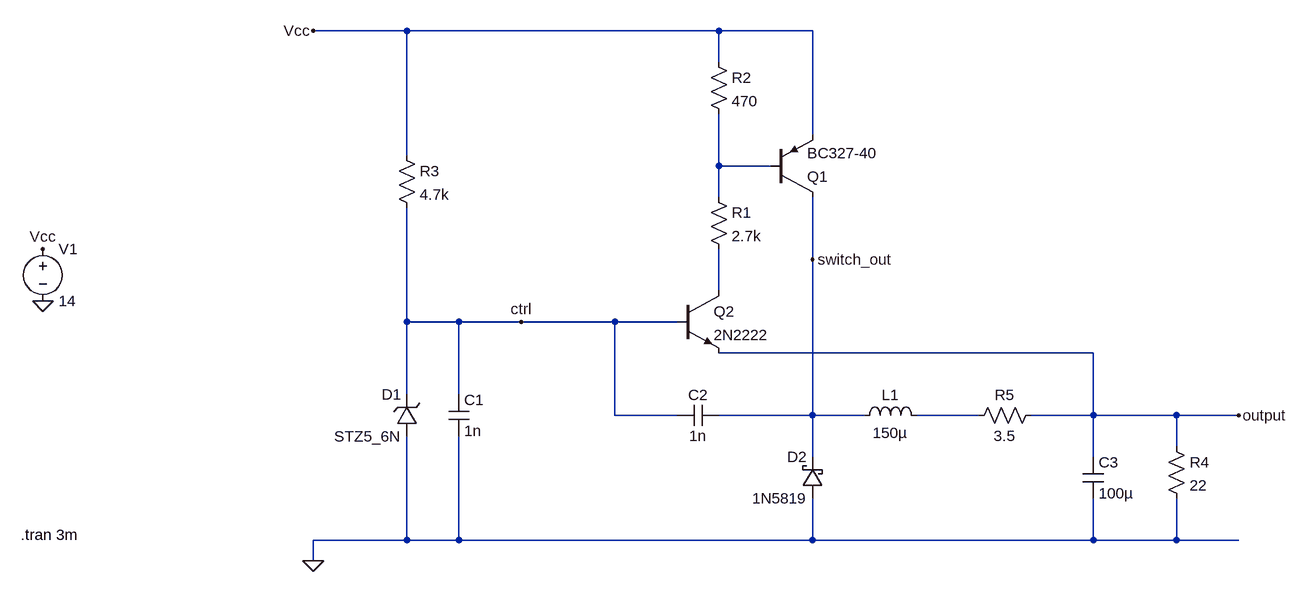
[diagram p0: schematic black_regulator.asc]
black_regulator.asc, the LTspice schematic file:
Version 4
SHEET 1 1008 788
WIRE -368 -48 -512 -48
WIRE 112 -48 -368 -48
WIRE 256 -48 112 -48
WIRE 112 0 112 -48
WIRE 256 112 256 -48
WIRE -368 144 -368 -48
WIRE 112 160 112 80
WIRE 192 160 112 160
WIRE 112 208 112 160
WIRE 256 304 256 208
WIRE 112 352 112 288
WIRE -368 400 -368 224
WIRE -288 400 -368 400
WIRE -192 400 -288 400
WIRE -48 400 -192 400
WIRE 48 400 -48 400
WIRE 688 448 112 448
WIRE -368 512 -368 400
WIRE -288 512 -288 400
WIRE -48 544 -48 400
WIRE 48 544 -48 544
WIRE 256 544 256 304
WIRE 256 544 112 544
WIRE 336 544 256 544
WIRE 512 544 416 544
WIRE 688 544 688 448
WIRE 688 544 592 544
WIRE 816 544 688 544
WIRE 912 544 816 544
WIRE 816 592 816 544
WIRE 256 608 256 544
WIRE 688 608 688 544
WIRE -368 736 -368 576
WIRE -368 736 -512 736
WIRE -288 736 -288 576
WIRE -288 736 -368 736
WIRE 256 736 256 672
WIRE 256 736 -288 736
WIRE 688 736 688 672
WIRE 688 736 256 736
WIRE 816 736 816 672
WIRE 816 736 688 736
WIRE 912 736 816 736
WIRE -512 768 -512 736
FLAG -512 -48 Vcc
FLAG 912 544 output
FLAG -512 768 0
FLAG -928 368 0
FLAG -928 288 Vcc
FLAG -192 400 ctrl
FLAG 256 304 switch_out
SYMBOL pnp 192 208 M180
SYMATTR InstName Q1
SYMATTR Value BC327-40
SYMBOL npn 48 352 R0
SYMATTR InstName Q2
SYMATTR Value 2N2222
SYMBOL res 96 192 R0
SYMATTR InstName R1
SYMATTR Value 2.7k
SYMBOL res 96 -16 R0
SYMATTR InstName R2
SYMATTR Value 470
SYMBOL res -384 128 R0
SYMATTR InstName R3
SYMATTR Value 4.7k
SYMBOL zener -352 576 R180
WINDOW 0 24 64 Left 2
WINDOW 3 24 0 Left 2
SYMATTR InstName D1
SYMATTR Value STZ5_6N
SYMATTR Description Diode
SYMATTR Type diode
SYMBOL cap -304 512 R0
SYMATTR InstName C1
SYMATTR Value 1n
SYMBOL cap 112 528 R90
WINDOW 0 0 32 VBottom 2
WINDOW 3 32 32 VTop 2
SYMATTR InstName C2
SYMATTR Value 1n
SYMBOL schottky 272 672 R180
WINDOW 0 24 64 Left 2
WINDOW 3 24 0 Left 2
SYMATTR InstName D2
SYMATTR Value 1N5819
SYMATTR Description Diode
SYMATTR Type diode
SYMBOL ind 320 560 R270
WINDOW 0 32 56 VTop 2
WINDOW 3 5 56 VBottom 2
SYMATTR InstName L1
SYMATTR Value 150µ
SYMBOL cap 672 608 R0
SYMATTR InstName C3
SYMATTR Value 100µ
SYMBOL voltage -928 272 R0
WINDOW 123 0 0 Left 0
WINDOW 39 0 0 Left 0
SYMATTR InstName V1
SYMATTR Value 14
SYMBOL res 800 576 R0
SYMATTR InstName R4
SYMATTR Value 22
SYMBOL res 608 528 R90
WINDOW 0 0 56 VBottom 2
WINDOW 3 32 56 VTop 2
SYMATTR InstName R5
SYMATTR Value 3.5
TEXT -962 728 Left 2 !.tran 3m

The netlist it stands for:
* black_regulator.asc
Q1 switch_out N001 Vcc 0 BC327-40
Q2 N002 ctrl output 0 2N2222
R1 N001 N002 2.7k
R2 Vcc N001 470
R3 Vcc ctrl 4.7k
D1 0 ctrl STZ5_6N
C1 ctrl 0 1n
C2 switch_out ctrl 1n
D2 0 switch_out 1N5819
L1 switch_out N003 150µ
C3 output 0 100µ
V1 Vcc 0 14
R4 output 0 22
R5 output N003 3.5
.model D D
.lib standard.dio
.model NPN NPN
.model PNP PNP
.lib standard.bjt
.tran 3m
.backanno
.end